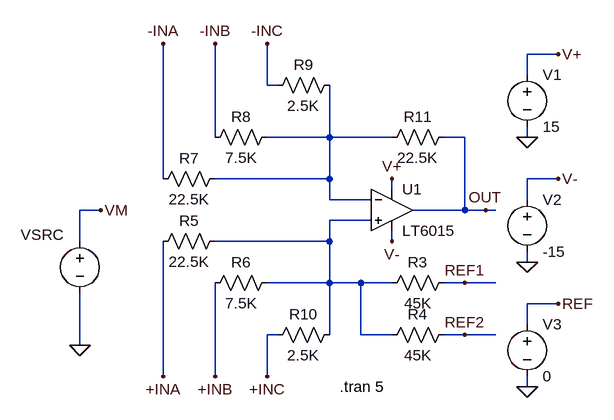
[diagram p0: schematic LT1997d3GeneralCaseSEInv.asc]
LT1997d3GeneralCaseSEInv.asc, the LTspice schematic file:
Version 4
SHEET 1 1176 680
WIRE 976 -48 928 -48
WIRE 928 -16 928 -48
WIRE 528 0 528 -64
WIRE 544 0 528 0
WIRE 448 80 448 -64
WIRE 624 80 624 0
WIRE 624 80 528 80
WIRE 720 80 624 80
WIRE 832 80 800 80
WIRE 928 80 928 64
WIRE 368 144 368 -64
WIRE 624 144 624 80
WIRE 624 144 448 144
WIRE 976 144 928 144
WIRE 720 160 720 144
WIRE 624 176 624 144
WIRE 688 176 624 176
WIRE 928 176 928 144
WIRE 272 192 240 192
WIRE 832 192 832 80
WIRE 832 192 752 192
WIRE 864 192 832 192
WIRE 880 192 864 192
WIRE 688 208 624 208
WIRE 240 240 240 192
WIRE 624 240 624 208
WIRE 624 240 448 240
WIRE 720 240 720 224
WIRE 928 272 928 256
WIRE 624 304 624 240
WIRE 624 304 528 304
WIRE 672 304 624 304
WIRE 720 304 672 304
WIRE 832 304 800 304
WIRE 880 304 832 304
WIRE 976 336 928 336
WIRE 928 368 928 336
WIRE 544 384 528 384
WIRE 624 384 624 304
WIRE 672 384 672 304
WIRE 720 384 672 384
WIRE 832 384 800 384
WIRE 880 384 832 384
WIRE 240 400 240 320
WIRE 368 448 368 240
WIRE 448 448 448 304
WIRE 528 448 528 384
WIRE 928 464 928 448
FLAG 720 144 V+
FLAG 720 240 V-
FLAG 528 -64 -INC
FLAG 448 -64 -INB
FLAG 368 -64 -INA
FLAG 528 448 +INC
FLAG 448 448 +INB
FLAG 368 448 +INA
FLAG 928 80 0
FLAG 928 272 0
FLAG 976 -48 V+
FLAG 976 144 V-
FLAG 240 400 0
FLAG 272 192 VM
FLAG 864 192 OUT
FLAG 832 304 REF1
FLAG 832 384 REF2
FLAG 928 464 0
FLAG 976 336 REF
SYMBOL Opamps\\LT6015 720 192 R0
SYMATTR InstName U1
SYMBOL res 464 224 R90
WINDOW 0 0 56 VBottom 2
WINDOW 3 32 56 VTop 2
SYMATTR InstName R5
SYMATTR Value 22.5K
SYMBOL res 544 288 R90
WINDOW 0 0 56 VBottom 2
WINDOW 3 32 56 VTop 2
SYMATTR InstName R6
SYMATTR Value 7.5K
SYMBOL res 464 128 R90
WINDOW 0 0 56 VBottom 2
WINDOW 3 32 56 VTop 2
SYMATTR InstName R7
SYMATTR Value 22.5K
SYMBOL res 544 64 R90
WINDOW 0 0 56 VBottom 2
WINDOW 3 32 56 VTop 2
SYMATTR InstName R8
SYMATTR Value 7.5K
SYMBOL res 640 -16 R90
WINDOW 0 0 56 VBottom 2
WINDOW 3 32 56 VTop 2
SYMATTR InstName R9
SYMATTR Value 2.5K
SYMBOL res 640 368 R90
WINDOW 0 0 56 VBottom 2
WINDOW 3 32 56 VTop 2
SYMATTR InstName R10
SYMATTR Value 2.5K
SYMBOL res 816 64 R90
WINDOW 0 0 56 VBottom 2
WINDOW 3 32 56 VTop 2
SYMATTR InstName R11
SYMATTR Value 22.5K
SYMBOL res 816 288 R90
WINDOW 0 0 56 VBottom 2
WINDOW 3 32 56 VTop 2
SYMATTR InstName R3
SYMATTR Value 45K
SYMBOL res 816 368 R90
WINDOW 0 0 56 VBottom 2
WINDOW 3 32 56 VTop 2
SYMATTR InstName R4
SYMATTR Value 45K
SYMBOL voltage 928 -32 R0
WINDOW 123 0 0 Left 2
WINDOW 39 0 0 Left 2
SYMATTR InstName V1
SYMATTR Value 15
SYMBOL voltage 928 160 R0
WINDOW 123 0 0 Left 2
WINDOW 39 0 0 Left 2
SYMATTR InstName V2
SYMATTR Value -15
SYMBOL voltage 928 352 R0
WINDOW 123 0 0 Left 2
WINDOW 39 0 0 Left 2
SYMATTR InstName V3
SYMATTR Value 0
SYMBOL voltage 240 224 R0
WINDOW 0 -91 6 Left 2
WINDOW 123 0 0 Left 2
WINDOW 39 0 0 Left 2
WINDOW 3 24 96 Invisible 2
SYMATTR InstName VSRC
SYMATTR Value PWL(0 -100 1 -100 3 100)
TEXT 640 464 Left 2 !.tran 5

The netlist it stands for:
* LT1997d3GeneralCaseSEInv.asc
XU1 N002 N001 V+ V- OUT LT6016  ; LT6015, pins In+ In- V+ V- OUT
R5 N002 +INA 22.5K
R6 N002 +INB 7.5K
R7 N001 -INA 22.5K
R8 N001 -INB 7.5K
R9 N001 -INC 2.5K
R10 N002 +INC 2.5K
R11 OUT N001 22.5K
R3 REF1 N002 45K
R4 REF2 N002 45K
V1 V+ 0 15
V2 V- 0 -15
V3 REF 0 0
VSRC VM 0 PWL(0 -100 1 -100 3 100)
.tran 5
.lib LTC2.lib
.backanno
.end